# Altium schematic sheet Op.SchDoc
size 203 x 101 mm
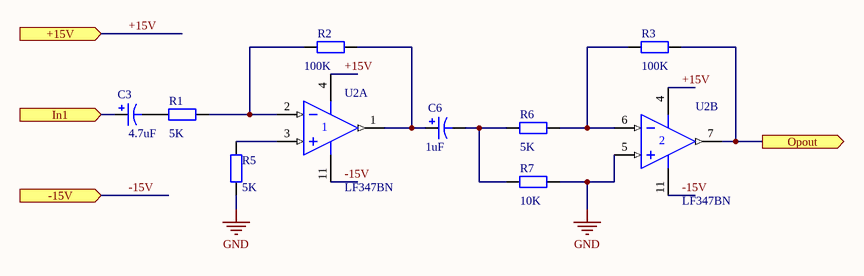
[diagram p0: Op.SchDoc]

## Parts
C3  value 4.7uF  [RB7.6-15]  (hidden comment: Cap Pol1)
C6  value 1uF  [RB7.6-15]  (hidden comment: Cap Pol1)
R1  value 5K  [AXIAL-0.4]  (hidden comment: Res2)
R2  value 100K  [AXIAL-0.4]  (hidden comment: Res2)
R3  value 100K  [AXIAL-0.4]  (hidden comment: Res2)
R5  value 5K  [AXIAL-0.4]  (hidden comment: Res2)
R6  value 5K  [AXIAL-0.4]  (hidden comment: Res2)
R7  value 10K  [AXIAL-0.4]  (hidden comment: Res2)
U2  LF347BN  [N14A]  (parts A,B of 4)

## Ports
+15V (in), -15V (in), In1 (in), Opout (out)

## Nets
GND: R5.1 R7.2 U2.5(IN+)
+15V: U2.4(V+) ; port +15V
-15V: U2.11(V-) ; port -15V
In1: C3.1 ; port In1
Opout: R3.2 U2.7(OUT) ; port Opout
NetC3_2: C3.2 R1.2
NetC6_1: C6.1 R2.2 U2.1(OUT)
NetC6_2: C6.2 R6.1 R7.1
NetR1_1: R1.1 R2.1 U2.2(IN-)
NetR3_1: R3.1 R6.2 U2.6(IN-)
NetR5_2: R5.2 U2.3(IN+)

## Library data of the parts
C3 C6 = Cap Pol1: Polarized Capacitor (Radial); Published: 8-Jun-2000; LatestRevisionDate: 17-Jul-2002; LatestRevisionNote: Re-released for DXP Platform.; PackageReference: RB7.6-15; Publisher: Altium Limited
R1-R3 R5-R7 = Res2: Resistor; Published: 8-Jun-2000; LatestRevisionDate: 17-Jul-2002; LatestRevisionNote: Re-released for DXP Platform.; PackageReference: AXIAL-0.4; Publisher: Altium Limited
U2 = LF347BN: Wide-Bandwidth Quad JFET Input Operational Amplifier; Published: 15-Apr-2002; LatestRevisionDate: 06-Jun-2005; LatestRevisionNote: Stylized 3D Model Added.; DatasheetVersion: May-1999; PackageVersion: 2000; PackageReference: N14A; Publisher: Altium Limited; PackageDescription: DIP; 14 Leads; Row Spacing 7.62 mm; Pitch 2.54 mm; ComponentLink1Description: Manufacturer Link; ComponentLink1URL: http://www.national.com/; ComponentLink2Description: Datasheet; ComponentLink2URL: http://www.national.com/ds.cgi/LF/LF147.pdf; ComponentLink3Description: URL Link1; ComponentLink3URL: http://www.national.com/pf/LF/LF347.html